# Altium schematic sheet PAGE3 - HUB, USB, ETH.SchDoc (part 2 of 2)
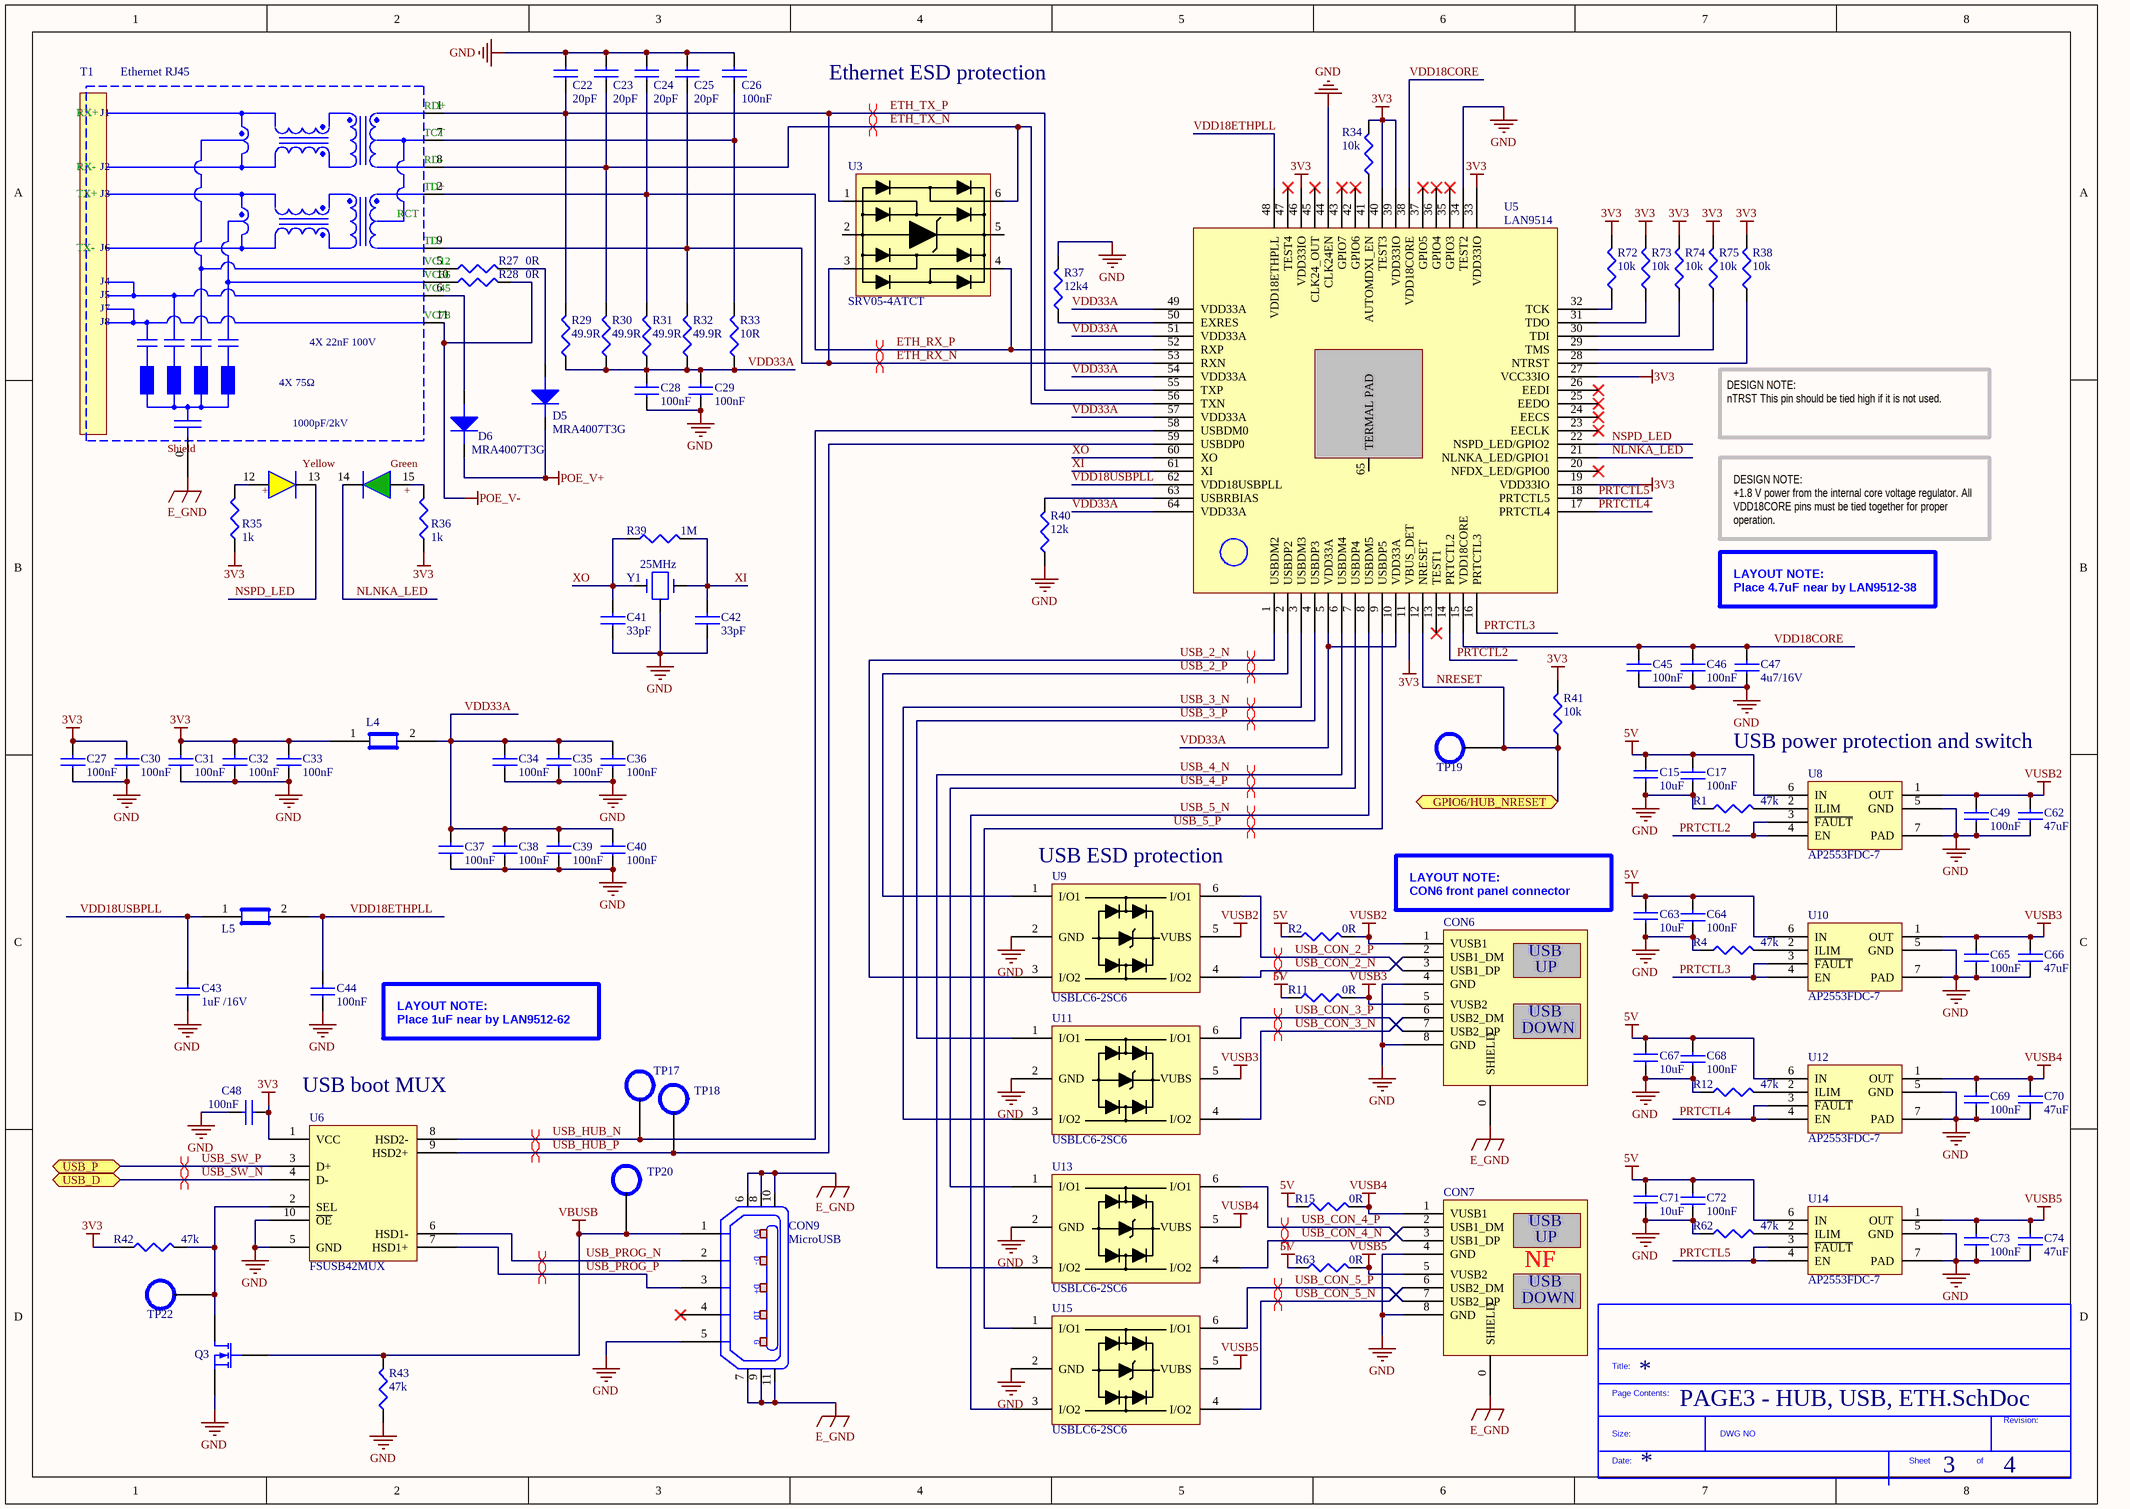
[diagram p1: PAGE3 - HUB, USB, ETH.SchDoc]

## Library data of the parts
C15 C63 C67 C71 = 10uF /50V: MURATA - GRM31CR61H106KA12L - CAP, MLCC, X5R, 10UF, 50V, 1206; Supplier 1: Farnell; Manufacturer: MURATA; Manufacturer Part Number: GRM31CR61H106KA12L; RoHS: YES; Stock 1: 51830; Pricing 1: 5=0.368, 50=0.214, 250=0.196, 500=0.178, 1000=0.159 (GBP); ComponentLink1URL: http://www.farnell.com/datasheets/2048767.pdf; ComponentLink1Description: http://www.farnell.com/datasheets/2048767.pdf; Supplier Part Number 1: 1845762
C17 C26-C40 C44-C46 C48 C49 C64 C65 C68 C69 C72 C73 = 100nF: MURATA - GRM188R71C104KA01J - CAP, MLCC, X7R, 0.1UF, 16V, 0603; Ceramic Capacitor Case: 0603 [1608 Metric]; Capacitance: 0.1; Voltage Rating: 16; Capacitance Tolerance: ± 10%; Dielectric Characteristic: X7; Product Range: GRM Series; SVHC: No SVHC (20-Jun-2016; Supplier 1: Farnell; Manufacturer: MURATA; Manufacturer Part Number: GRM188R71C104KA01J; RoHS: YES; Stock 1: 18297; Pricing 1: 10=0.0145, 100=0.0126, 500=0.0081, 2500=0.0059, 5000=0.0052, 10000=0.0046, 50000=0.0036, 100000=0.0035 (GBP); Packaging: Cut Tape; Operating Temperature Min: -55; Operating Temperature Max: 125; Automotive Qualification Standard: -; MSL: MSL 1 - Unlimited; ComponentLink1URL: http://www.farnell.com/datasheets/2189124.pdf; ComponentLink1Description: http://www.farnell.com/datasheets/2189124.pdf; Supplier Part Number 1: 2688519
C22-C25 = GRM1885C1H200JA01D: MURATA - GRM1885C1H200JA01D - CAPACITOR, MLCC, C0G, 20PF, 50V, 0603; Ceramic Capacitor Case: 0603 [1608 Metric]; Capacitance: 20; Voltage Rating: 50; Capacitance Tolerance: ± 5%; Dielectric Characteristic: C0G / NP0; Product Range: GRM Series; SVHC: No SVHC (17-Dec-2015; Supplier 1: Farnell; Manufacturer: MURATA; Manufacturer Part Number: GRM1885C1H200JA01D; RoHS: YES; Stock 1: 5812; Pricing 1: 10=0.0245, 100=0.0159, 500=0.0123, 1000=0.0095, 2000=0.0093, 4000=0.0073, 20000=0.0062, 40000=0.0057 (GBP); Packaging: Cut Tape; Operating Temperature Min: -55; Operating Temperature Max: 125; Automotive Qualification Standard: -; MSL: MSL 1 - Unlimited; ComponentLink1URL: http://www.farnell.com/datasheets/2048077.pdf; ComponentLink1Description: http://www.farnell.com/datasheets/2048077.pdf; Supplier Part Number 1: 2456108
C41 C42 = GRM1885C1H330JA01D: MURATA - GRM1885C1H330JA01D - CAP, MLCC, C0G/NP0, 33PF, 50V, 0603; Ceramic Capacitor Case: 0603 [1608 Metric]; Capacitance: 33; Voltage Rating: 50; Capacitance Tolerance: ± 5%; Product Range: GRM Series; SVHC: No SVHC (17-Dec-2015); Capacitor Terminals: SMD<!--FANDB--><div class="features-and-benefits-container"><div class="features-and-benefits-description"><span class="features-benefits-value">The Murata GRM series capacitors are Multilayer Ceramic Chip Capacitors (MLCC) used for general purpose applications. These MLCC capacitors are classified into temperature compensating and high dielectric constant types depending on the change in electrostatic capacitance due to change in temperature. The temperature compensating capacitors feature a small rate of change in electrostatic capacitance as the temperature changes and are used for applications such as filters and high frequency circuit matching. The high dielectric constant capacitors use materials with a high dielectric constant and feature a large electrostatic capacitance. Typical applications are power supply decoupling and smoothing circuits.</span></div><div class="features-and-benefits-list"><ul class="features-and-benefits-list-list"><li class="features-and-benefits-list-item">Large capacity and small size in a multilayer structure</li><li class="features-and-benefits-list-item">Capacitance value ranging from 0.1pF to 220?F</li><li class="features-and-benefits-list-item">Tin plated external electrodes, excellent solderability</li><li class="features-and-benefits-list-item">Provides good high frequency characteristics</li><li class="features-and-benefits-list-item">Excellent pulse response</li><li class="features-and-benefits-list-item">High reliability</li><li class="features-and-benefits-list-item">Capacitor size varies from 0.4×0.2mm to 5.7×5.0mm</li><li class="features-and-benefits-list-item">Rated voltage of 2.5VDC to 3.15; Supplier 1: Farnell; Manufacturer: MURATA; Manufacturer Part Number: GRM1885C1H330JA01D; RoHS: YES; Stock 1: 11752; Pricing 1: 10=0.0153, 100=0.0104, 500=0.0085, 1000=0.0069, 2000=0.0063 (GBP); Dielectric Characteristic: C0G / NP0; Packaging: Cut Tape; Operating Temperature Min: -55; Operating Temperature Max: 125; Automotive Qualification Standard: -; MSL: -; Capacitance Tolerance ±: ± 5%; ComponentLink1URL: http://www.farnell.com/datasheets/2048656.pdf; ComponentLink1Description: http://www.farnell.com/datasheets/2048656.pdf; Supplier Part Number 1: 1828910
C43 = GRM188R61C105KA12D: MURATA - GRM188R61C105KA12D - CAP, MLCC, X5R, 1UF, 16V, 0603; Ceramic Capacitor Case: 0603 [1608 Metric]; Capacitance: 1; Voltage Rating: 16; Capacitance Tolerance: ± 10%; Dielectric Characteristic: X5; Product Range: GRM Series; SVHC: No SVHC (17-Dec-2015); Capacitance Tolerance ±: ± 10%<!--FANDB--><div class="features-and-benefits-container"><div class="features-and-benefits-description"><span class="features-benefits-value">The Murata GRM series capacitors are Multilayer Ceramic Chip Capacitors (MLCC) used for general purpose applications. These MLCC capacitors are classified into temperature compensating and high dielectric constant types depending on the change in electrostatic capacitance due to change in temperature. The temperature compensating capacitors feature a small rate of change in electrostatic capacitance as the temperature changes and are used for applications such as filters and high frequency circuit matching. The high dielectric constant capacitors use materials with a high dielectric constant and feature a large electrostatic capacitance. Typical applications are power supply decoupling and smoothing circuits.</span></div><div class="features-and-benefits-list"><ul class="features-and-benefits-list-list"><li class="features-and-benefits-list-item">Large capacity and small size in a multilayer structure</li><li class="features-and-benefits-list-item">Capacitance value ranging from 0.1pF to 220?F</li><li class="features-and-benefits-list-item">Tin plated external electrodes, excellent solderability</li><li class="features-and-benefits-list-item">Provides good high frequency characteristics</li><li class="features-and-benefits-list-item">Excellent pulse response</li><li class="features-and-benefits-list-item">High reliability</li><li class="features-and-benefits-list-item">Capacitor size varies from 0.4×0.2mm to 5.7×5.0mm</li><li class="features-and-benefits-list-item">Rated voltage of 2.5VDC to 3.15; Supplier 1: Farnell; Manufacturer: MURATA; Manufacturer Part Number: GRM188R61C105KA12D; RoHS: YES; Stock 1: 27380; Pricing 1: 10=0.0194, 100=0.013, 500=0.0101, 1000=0.0078, 2000=0.0074 (GBP); Packaging: Cut Tape; Operating Temperature Min: -55; Operating Temperature Max: 85; Automotive Qualification Standard: -; MSL: MSL 1 - Unlimited; ComponentLink1URL: http://www.farnell.com/datasheets/2047881.pdf; ComponentLink1Description: http://www.farnell.com/datasheets/2047881.pdf; ComponentLink2URL: http://www.farnell.com/datasheets/2006461.pdf; ComponentLink2Description: http://www.farnell.com/datasheets/2006461.pdf; Supplier Part Number 1: 2362099RL
C47 = 4u7  16V 0603: MURATA - GRM188R61C475KAAJD - CAP, MLCC, X5R, 4.7UF, 16V, 0603; Ceramic Capacitor Case: 0603 [1608 Metric]; Capacitance: 4.7; Voltage Rating: 16; Capacitance Tolerance: ± 10%; Dielectric Characteristic: X5; Product Range: GRM Series; SVHC: No SVHC (17-Dec-2015)<!--FANDB--><div class="features-and-benefits-container"><div class="features-and-benefits-desc-container"><span class="features-and-benefits-container-desc">SMD Multilayer Ceramic Capacitor, 0603 [1608 Metric], 4.7 µF, 16 V, ± 10%, X5; Supplier 1: Farnell; Manufacturer: MURATA; Manufacturer Part Number: GRM188R61C475KAAJD; RoHS: YES; Stock 1: 5038; Pricing 1: 10=0.16, 100=0.0929, 500=0.076, 1000=0.0618, 2000=0.0605, 4000=0.0425, 20000=0.0409, 40000=0.0355 (GBP); Packaging: Cut Tape; Operating Temperature Min: -55; Operating Temperature Max: 85; Automotive Qualification Standard: -; MSL: MSL 1 - Unlimited; ComponentLink1URL: http://www.farnell.com/datasheets/2079168.pdf; ComponentLink1Description: http://www.farnell.com/datasheets/2079168.pdf; Supplier Part Number 1: 2611924
C62 C66 C70 C74 = 47uF /10V: MURATA - GRM21BR61A476ME15L - CAP, MLCC, X5R, 47UF, 10V, 0805; Ceramic Capacitor Case: 0805 [2012 Metric]; Capacitance: 47; Voltage Rating: 10; Capacitance Tolerance: ± 20%; Dielectric Characteristic: X5; Product Range: GRM Series; SVHC: No SVHC (17-Dec-2015; Supplier 1: Farnell; Manufacturer: MURATA; Manufacturer Part Number: GRM21BR61A476ME15L; RoHS: YES; Stock 1: 27604; Pricing 1: 5=0.699, 50=0.295, 250=0.232, 500=0.193, 1500=0.171 (GBP); Packaging: Cut Tape; Operating Temperature Min: -55; Operating Temperature Max: 85; Automotive Qualification Standard: -; MSL: MSL 1 - Unlimited; ComponentLink1URL: http://www.farnell.com/datasheets/2079183.pdf; ComponentLink1Description: http://www.farnell.com/datasheets/2079183.pdf; Supplier Part Number 1: 2611939
CON6 CON7 = USB_2_CONN: USB 2.0 A Dual Port RA TH, PN0205
D5 D6 = MRA4007T3G: ON SEMICONDUCTOR - MRA4007T3G - DIODE, STANDARD, 1A, 1KV, SMA; Supplier 1: Farnell; Manufacturer: ON SEMICONDUCTOR; Manufacturer Part Number: MRA4007T3G; RoHS: YES; Stock 1: 92210; Pricing 1: 10=0.181, 100=0.0749, 500=0.0692, 1000=0.0478, 2500=0.0401 (GBP); ComponentLink1URL: http://www.onsemi.com/PowerSolutions/supportDoc.do?type=models&rpn=MRA4007; ComponentLink1Description: http://www.onsemi.com/PowerSolutions/supportDoc.do?type=models&rpn=MRA4007; ComponentLink2URL: http://www.farnell.com/datasheets/2028669.pdf; ComponentLink2Description: http://www.farnell.com/datasheets/2028669.pdf; ComponentLink3URL: http://www.farnell.com/datasheets/2037280.pdf; ComponentLink3Description: http://www.farnell.com/datasheets/2037280.pdf; Supplier Part Number 1: 1459137
L4 L5 = BLM18EG221SN1D: MURATA - BLM18EG221SN1D - FERRITE BEAD, 0.05OHM, 2A, 0603; Impedance @ 100MHz: 220; Ferrite Case Style: 0603 [1608 Metric]; Product Range: BLM18; DC Current Rating: 2; DC Resistance Max: 0.05; Impedance Tolerance: ± 25%; SVHC: No SVHC (17-Dec-2015); Ferrite Mounting: SMD; Resistance: 0.05ohm<!--FANDB--><div class="features-and-benefits-container"><div class="features-and-benefits-description"><span class="features-benefits-value">The Murata BLM18EG series are EMIFIL chip ferrite beads for suppressing high frequency noise in GHz band general signal line applications. These chip ferrite beads are designed for reducing the possibility of resonance to provide undistorted signal waveform. EMIFIL chip ferrite beads do not require connection to ground so they are effectively used in circuits without stable ground lines. The nickel barrier structure of the external electrodes provides excellent solder heat resistance. BLM18EG series has modified internal electrode structure that minimizes stray capacitance and increases the effective frequency range.</span></div><div class="features-and-benefits-list"><ul class="features-and-benefits-list-list"><li class="features-and-benefits-list-item">EIA 0603 standard chip size</li><li class="features-and-benefits-list-item">Miniaturized ferrite beads</li><li class="features-and-benefits-list-item">Effective at low impedance line</li><li class="features-and-benefits-list-item">Available in selective impedance range values at 100MHz</li><li class="features-and-benefits-list-item">Low DC resistance</li><li class="features-and-benefits-list-item">Large rated current</li><li class="features-and-benefits-list-item">Excellent direct current characteristics</li><li class="features-and-benefits-list-item">Suitable for small and low profile equipments</li><li class="features-and-benefits-list-item">Operating temperature range -55°C to 125; Supplier 1: Farnell; Manufacturer: MURATA; Manufacturer Part Number: BLM18EG221SN1D; RoHS: YES; Stock 1: 36495; Pricing 1: 10=0.0777, 100=0.064, 500=0.0516, 1000=0.038, 2000=0.033, 4000=0.03, 20000=0.0295, 40000=0.0262 (GBP); Automotive Qualification Standard: -; Core Material: Ferrite; Operating Temperature Max: +125; Operating Temperature Min: -55; Packaging: Cut Tape; ComponentLink1URL: http://www.farnell.com/datasheets/5169.pdf; ComponentLink1Description: http://www.farnell.com/datasheets/5169.pdf; Supplier Part Number 1: 1515716
Q3 = DMG1012T-7: MOSFET MOSFET N-CHANNEL SOT-523; Manufacturer: Diodes Incorporated; Configuration: 1 N-Channel; Number of Channels: 1 Channel; Channel Mode: Enhancement; Fall Time: 12.3 ns; Id - Continuous Drain Current: 630 mA; Pd - Power Dissipation: 280 mW; Qg - Gate Charge: 736.6 pC; Rds On - Drain-Source Resistance: 300 mOhms; Rise Time: 7.4 ns; Typical Turn-Off Delay Time: 26.7 ns; Typical Turn-On Delay Time: 5.1 ns; Vds - Drain-Source Breakdown Voltage: 20 V; Vgs - Gate-Source Voltage: +/- 6 V; Vgs th - Gate-Source Threshold Voltage: 500 mV; Supplier 1: Mouser; Manufacturer Part Number: DMG1012T-7; RoHS: RoHS Compliant; Category: MOSFET; Stock 1: 1195; Pricing 1: 1=0.273, 10=0.187, 100=0.077, 1000=0.053, 3000=0.041, 9000=0.035, 24000=0.033, 45000=0.031, 99000=0.027 (EUR); Package/Case: SOT-523-3; Packaging: Reel; Product: MOSFET Small Signal; Series: DMG1012; Technology: Si; Transistor Type: 1 N-Channel; Brand: Diodes Incorporated; Mounting Style: SMD/SMT; Transistor Polarity: N-Channel; Maximum Operating Temperature: + 150 C; Minimum Operating Temperature: - 55 C; Standard Pack Qty: 3000; RoHS - Mouser: Y; Minimum Order Quantity: 1; Reeling: True; ComponentLink1URL: http://www.mouser.com/ds/2/115/ds31783-44973.pdf; ComponentLink1Description: http://www.mouser.com/ds/2/115/ds31783-44973.pdf; Supplier Part Number 1: 621-DMG1012T-7
R1 R4 R12 R62 = 47k: MULTICOMP - MCMR06X4702FTL - RES, CERAMIC, 47K, 1%, 0.1W, 0603; Resistance: 47; Voltage Rating: 75; Resistor Case Style: 0603 [1608 Metric]; Power Rating: 100; Product Range: MCMR Series; Temperature Coefficient: ± 100; Automotive Qualification Standard: -<!--FANDB--><div class="features-and-benefits-container"><div class="features-and-benefits-description"><span class="features-benefits-value">The Multicomp MCMR series resistors are automotive grade, anti sulphured thick film chip resistor. The resistance range includes E24 and E96 decade values from 1ohm to 10Mohm. These resistors are constructed on top of a high grade ceramic body.</span></div><div class="features-and-benefits-list"><ul class="features-and-benefits-list-list"><li class="features-and-benefits-list-item">EIA 0402, 0603, 0805, 1206 chip sizes available</li><li class="features-and-benefits-list-item">High reliability and stability</li><li class="features-and-benefits-list-item">Automotive grade AEC-Q200 compliant</li><li class="features-and-benefits-list-item">Complaint with (IEC 60068-1) 55/155/56 climatic category</li><li class="features-and-benefits-list-item">Maximum operation voltage of 50V, 75V, 150V and 200V</li><li class="features-and-benefits-list-item">Power rating of 62.5mW, 100mW, 125mW and 250mW</li><li class="features-and-benefits-list-item">Available in ±1% and ±5% tolerance</li><li class="features-and-benefits-list-item">Temperature coefficient (TCR) of +200ppm/°C, +100ppm/°C and -200ppm/°C to +400ppm/°C</li><li class="features-and-benefits-list-item">Operating temperature range -55°C to 155; Supplier 1: Farnell; Manufacturer: MULTICOMP; Manufacturer Part Number: MCMR06X4702FTL; RoHS: Y-EX; Stock 1: 21427; Pricing 1: 10=0.0115, 100=0.009, 500=0.0064, 1000=0.0051, 2500=0.0042, 5000=0.0032, 25000=0.0021, 50000=0.0017 (GBP); Resistance Tolerance: ± 1%; Packaging: Cut Tape; Resistor Element Material: Ceramic; ComponentLink1URL: http://www.farnell.com/datasheets/1716707.pdf; ComponentLink1Description: http://www.farnell.com/datasheets/1716707.pdf; Supplier Part Number 1: 2073510
R2 R11 R15 R63 = 0R: BOURNS - CR0603-J/-000ELF - RES, THICK FILM, 0R, 5%, 0.1W, 0603; Resistance: 0; Voltage Rating: 50; Resistor Case Style: 0603 [1608 Metric]; Power Rating: 100; Product Range: CR Series; SVHC: No SVHC (17-Dec-2015); Resistor Mounting: Surface Mount Device<!--FANDB--><div class="features-and-benefits-container"><div class="features-and-benefits-description"><span class="features-benefits-value">The Bourns CR series are standard thick film chip resistors. These resistors provide flexibility of performance, space saving and low cost. The Resistance range includes E96 and E24 decade values from 1ohm to 10Mohm.</span></div><div class="features-and-benefits-list"><ul class="features-and-benefits-list-list"><li class="features-and-benefits-list-item">0201, 0402, 0603, 0805, 1206, 1210, 2010, 2512 standard case sizes available</li><li class="features-and-benefits-list-item">±1% and ±5% tolerance</li><li class="features-and-benefits-list-item">±100ppm/°C, ±200ppm/°C and ±250ppm/°C TCR values available</li><li class="features-and-benefits-list-item">Power rating selectable for 50mW, 63mW, 0.1W, 0.125W, 0.25W, 0.5W and 1W based on ordering</li><li class="features-and-benefits-list-item">Jumpers are available for all size</li><li class="features-and-benefits-list-item">3 layer termination process with nickel barrier prevents leaching & provides excellent solderability</li><li class="features-and-benefits-list-item">Suitable for all type of soldering processes</li><li class="features-and-benefits-list-item">Tight dimensional tolerances</li><li class="features-and-benefits-list-item">Maximum working voltage depends on case size</li><li class="features-and-benefits-list-item">Operating temperature of -55°C to +125°C(CR0201) and -55°C to +155; Supplier 1: Farnell; Manufacturer: BOURNS; Manufacturer Part Number: CR0603-J/-000ELF; RoHS: YES; Stock 1: 58200; Pricing 1: 10=0.0146, 250=0.0097, 1000=0.0073, 5000=0.0049, 12500=0.0042 (GBP); Resistance Tolerance: ± 5%; Packaging: Cut Tape; Resistor Element Material: Thick Film; Temperature Coefficient: -; Automotive Qualification Standard: -; MSL: MSL 1 - Unlimited; ComponentLink1URL: http://www.bourns.com/engineering/CHPREZTR/cr0603.stp; ComponentLink1Description: http://www.bourns.com/engineering/CHPREZTR/cr0603.stp; ComponentLink2URL: http://www.farnell.com/datasheets/2178762.pdf; ComponentLink2Description: http://www.farnell.com/datasheets/2178762.pdf; Supplier Part Number 1: 2008343
R27 R28 = MCMR12X000 PTL: MULTICOMP - MCMR12X000 PTL - RES, CERAMIC, 0R, 0.05OHM, 0.25W, 1206; Resistance: 0; Voltage Rating: 200; Resistor Case Style: 1206 [3216 Metric]; Power Rating: 250; Resistance Tolerance: ± 0.05; Product Range: MCMR Series; Temperature Coefficient: -200ppm/°C to +400; Automotive Qualification Standard: -<!--FANDB--><div class="features-and-benefits-container"><div class="features-and-benefits-description"><span class="features-benefits-value">The Multicomp MCMR series resistors are automotive grade, anti sulphured thick film chip resistor. The resistance range includes E24 and E96 decade values from 1ohm to 10Mohm. These resistors are constructed on top of a high grade ceramic body.</span></div><div class="features-and-benefits-list"><ul class="features-and-benefits-list-list"><li class="features-and-benefits-list-item">EIA 0402, 0603, 0805, 1206 chip sizes available</li><li class="features-and-benefits-list-item">High reliability and stability</li><li class="features-and-benefits-list-item">Automotive grade AEC-Q200 compliant</li><li class="features-and-benefits-list-item">Complaint with (IEC 60068-1) 55/155/56 climatic category</li><li class="features-and-benefits-list-item">Maximum operation voltage of 50V, 75V, 150V and 200V</li><li class="features-and-benefits-list-item">Power rating of 62.5mW, 100mW, 125mW and 250mW</li><li class="features-and-benefits-list-item">Available in ±1% and ±5% tolerance</li><li class="features-and-benefits-list-item">Temperature coefficient (TCR) of +200ppm/°C, +100ppm/°C and -200ppm/°C to +400ppm/°C</li><li class="features-and-benefits-list-item">Operating temperature range -55°C to 155; Supplier 1: Farnell; Manufacturer: MULTICOMP; Manufacturer Part Number: MCMR12X000 PTL; RoHS: Y-EX; Stock 1: 526857; Pricing 1: 10=0.0252, 100=0.0179, 500=0.0111, 1000=0.0092, 2500=0.0069, 5000=0.0055, 25000=0.0037, 50000=0.0029 (GBP); Packaging: Cut Tape; Resistor Element Material: Ceramic; ComponentLink1URL: http://www.farnell.com/datasheets/1716709.pdf; ComponentLink1Description: http://www.farnell.com/datasheets/1716709.pdf; Supplier Part Number 1: 2073874
R29-R32 = CRCW060349R9FKEA: VISHAY - CRCW060349R9FKEA - RES, THICK FILM, 49R9, 1%, 0.1W, 0603; Resistance: 49.9; Voltage Rating: 75; Resistor Case Style: 0603 [1608 Metric]; Power Rating: 100; Product Range: CRCW Series; Temperature Coefficient: ± 100; Automotive Qualification Standard: AEC-Q200; Resistor Mounting: Surface Mount Device<!--FANDB--><div class="features-and-benefits-container"><div class="features-and-benefits-description"><span class="features-benefits-value">The Vishay D/CRCW e3 series are standard thick film chip resistors. The resistance range includes E96 and E24 decade values from 1ohm to 10Mohm. CRCW e3 series resistors have a pure tin solder contacts on the Ni barrier layer that provides compatibility with reflow soldering process.</span></div><div class="features-and-benefits-list"><ul class="features-and-benefits-list-list"><li class="features-and-benefits-list-item">Automotive grade AEC-Q200 qualified</li><li class="features-and-benefits-list-item">EIA 0402, 0603, 0805, 1206, 1210, 1218, 2010, 2512 standard case sizes available</li><li class="features-and-benefits-list-item">Stability &Delta; Supplier 1: Farnell; Manufacturer: VISHAY; Manufacturer Part Number: CRCW060349R9FKEA; RoHS: Y-EX; Stock 1: 45411; Pricing 1: 10=0.0158, 100=0.0094, 500=0.0071, 1000=0.0052, 2500=0.0047 (GBP); Resistance Tolerance: ± 1%; Packaging: Cut Tape; Resistor Element Material: Thick Film; MSL: MSL 1 - Unlimited; ComponentLink1URL: http://www.farnell.com/datasheets/2111203.pdf; ComponentLink1Description: http://www.farnell.com/datasheets/2111203.pdf; ComponentLink2URL: http://www.farnell.com/cad/1552291.zip; ComponentLink2Description: http://www.farnell.com/cad/1552291.zip; Supplier Part Number 1: 1469817
R33 = RCA060310R0FKEA: VISHAY - RCA060310R0FKEA - RES, AUTO, THICK FILM, 10R, 1%, 0603; Resistance: 10; Voltage Rating: 75; Resistor Case Style: 0603 [1608 Metric]; Power Rating: 100; Product Range: RCA Series; Temperature Coefficient: ± 100; Automotive Qualification Standard: AEC-Q200; SVHC: No SVHC (17-Dec-2015)<!--FANDB--><div class="features-and-benefits-container"><div class="features-and-benefits-description"><span class="features-benefits-value">The RCA series from Vishay are automotive grade, sulphur resistant thick film rectangular chip resistors. The resistance range includes E24 and E96 decade values from 1ohm to 10Mohm. They provide superior resistance against H2S atmosphere. These resistors have metal glaze on high quality ceramic.</span></div><div class="features-and-benefits-list"><ul class="features-and-benefits-list-list"><li class="features-and-benefits-list-item">Automotive grade AEC-Q200 qualified (rev C)</li><li class="features-and-benefits-list-item">EIA 0402, 0603, 0805, 1206, 1210, 1218, 2010 and 2512 case sizes available</li><li class="features-and-benefits-list-item">Available in ±0.5%, ±1% and ±5% tolerances</li><li class="features-and-benefits-list-item">Jumpers are also available</li><li class="features-and-benefits-list-item">±50ppm/K, ±100ppm/K and ±200ppm/K TCR values</li><li class="features-and-benefits-list-item">Power rating of 0.063W, 0.10W, 0.125W, 0.25W, 0.5W, 0.75W and 1W at 70?C</li><li class="features-and-benefits-list-item">Available in 50V, 75V, 150V, 200V, 400V and 500V limiting voltage options</li><li class="features-and-benefits-list-item">Category temperature range from -55?C to 155?C</li><li class="features-and-benefits-list-item">Stability ?R/R = 1 % for 1000h at 70; Supplier 1: Farnell; Manufacturer: VISHAY; Manufacturer Part Number: RCA060310R0FKEA; RoHS: YES; Stock 1: 9559; Pricing 1: 10=0.0803, 100=0.0386, 500=0.0235, 2500=0.015, 5000=0.0135, 10000=0.0108, 50000=0.0068, 100000=0.0067 (GBP); Resistance Tolerance: ± 1%; Packaging: Cut Tape; Resistor Element Material: Thick Film; ComponentLink1URL: http://www.farnell.com/datasheets/2111201.pdf; ComponentLink1Description: http://www.farnell.com/datasheets/2111201.pdf; Supplier Part Number 1: 2616585
R34 R38 R41 R72-R75 = MCMR06X103 JTL: MULTICOMP - MCMR06X103 JTL - RES, CERAMIC, 10K, 5%, 0.1W, 0603; Resistance: 10; Voltage Rating: 75; Resistor Case Style: 0603 [1608 Metric]; Power Rating: 100; Product Range: MCMR Series; Temperature Coefficient: ± 100; Automotive Qualification Standard: -<!--FANDB--><div class="features-and-benefits-container"><div class="features-and-benefits-description"><span class="features-benefits-value">The Multicomp MCMR series resistors are automotive grade, anti sulphured thick film chip resistor. The resistance range includes E24 and E96 decade values from 1ohm to 10Mohm. These resistors are constructed on top of a high grade ceramic body.</span></div><div class="features-and-benefits-list"><ul class="features-and-benefits-list-list"><li class="features-and-benefits-list-item">EIA 0402, 0603, 0805, 1206 chip sizes available</li><li class="features-and-benefits-list-item">High reliability and stability</li><li class="features-and-benefits-list-item">Automotive grade AEC-Q200 compliant</li><li class="features-and-benefits-list-item">Complaint with (IEC 60068-1) 55/155/56 climatic category</li><li class="features-and-benefits-list-item">Maximum operation voltage of 50V, 75V, 150V and 200V</li><li class="features-and-benefits-list-item">Power rating of 62.5mW, 100mW, 125mW and 250mW</li><li class="features-and-benefits-list-item">Available in ±1% and ±5% tolerance</li><li class="features-and-benefits-list-item">Temperature coefficient (TCR) of +200ppm/°C, +100ppm/°C and -200ppm/°C to +400ppm/°C</li><li class="features-and-benefits-list-item">Operating temperature range -55°C to 155; Supplier 1: Farnell; Manufacturer: MULTICOMP; Manufacturer Part Number: MCMR06X103 JTL; RoHS: Y-EX; Stock 1: 19791; Pricing 1: 10=0.0087, 100=0.0074, 500=0.0061, 1000=0.0048, 2500=0.0032, 5000=0.0024, 25000=0.0016, 50000=0.0013 (GBP); Resistance Tolerance: ± 5%; Packaging: Cut Tape; Resistor Element Material: Ceramic; ComponentLink1URL: http://www.farnell.com/datasheets/1716707.pdf; ComponentLink1Description: http://www.farnell.com/datasheets/1716707.pdf; Supplier Part Number 1: 2073356
R35 R36 = MCMR06X102 JTL: MULTICOMP - MCMR06X102 JTL - RES, CERAMIC, 1K, 5%, 0.1W, 0603; Resistance: 1; Voltage Rating: 75; Resistor Case Style: 0603 [1608 Metric]; Power Rating: 100; Product Range: MCMR Series; Temperature Coefficient: ± 100; Resistor Mounting: Surface Mount Device<!--FANDB--><div class="features-and-benefits-container"><div class="features-and-benefits-description"><span class="features-benefits-value">The Multicomp MCMR series resistors are automotive grade, anti sulphured thick film chip resistor. The resistance range includes E24 and E96 decade values from 1ohm to 10Mohm. These resistors are constructed on top of a high grade ceramic body.</span></div><div class="features-and-benefits-list"><ul class="features-and-benefits-list-list"><li class="features-and-benefits-list-item">EIA 0402, 0603, 0805, 1206 chip sizes available</li><li class="features-and-benefits-list-item">High reliability and stability</li><li class="features-and-benefits-list-item">Automotive grade AEC-Q200 compliant</li><li class="features-and-benefits-list-item">Complaint with (IEC 60068-1) 55/155/56 climatic category</li><li class="features-and-benefits-list-item">Maximum operation voltage of 50V, 75V, 150V and 200V</li><li class="features-and-benefits-list-item">Power rating of 62.5mW, 100mW, 125mW and 250mW</li><li class="features-and-benefits-list-item">Available in ±1% and ±5% tolerance</li><li class="features-and-benefits-list-item">Temperature coefficient (TCR) of +200ppm/°C, +100ppm/°C and -200ppm/°C to +400ppm/°C</li><li class="features-and-benefits-list-item">Operating temperature range -55°C to 155; Supplier 1: Farnell; Manufacturer: MULTICOMP; Manufacturer Part Number: MCMR06X102 JTL; RoHS: Y-EX; Stock 1: 18133; Pricing 1: 10=0.0089, 100=0.0076, 500=0.0063, 1000=0.0049, 2500=0.0033, 5000=0.0024, 25000=0.0016, 50000=0.0013 (GBP); Resistance Tolerance: ± 5%; Packaging: Cut Tape; Resistor Element Material: Ceramic; Automotive Qualification Standard: -; ComponentLink1URL: http://www.farnell.com/datasheets/1716707.pdf; ComponentLink1Description: http://www.farnell.com/datasheets/1716707.pdf; Supplier Part Number 1: 2073354
R37 = MC0063W0603112K4: MULTICOMP - MC0063W0603112K4 - RES, THICK FILM, 12K4, 1%, 0.063W, 0603; Resistance: 12.4; Voltage Rating: 50; Resistor Case Style: 0603 [1608 Metric]; Power Rating: 63; Product Range: MC Series; Temperature Coefficient: ± 100; SVHC: No SVHC (17-Dec-2015); External Depth: 0.45; External Length / Height: 1.6; External Width: 0.8; No. of Pins: 2; Reel Quantity: 5000; Resistor Mounting: Surface Mount Device; Temperature Coeff. +: 100; Voltage Rating V DC: 50V<!--FANDB--><div class="features-and-benefits-container"><div class="features-and-benefits-description"><span class="features-benefits-value">The Multicomp MC series current sense resistors are thick film chip resistors. The resistance range includes E96 and E24 decade values from 1ohm to 10Mohm.</span></div><div class="features-and-benefits-list"><ul class="features-and-benefits-list-list"><li class="features-and-benefits-list-item">EIA 0402, 0603, 0805, 1206 chip sizes available</li><li class="features-and-benefits-list-item">Small size and low weight</li><li class="features-and-benefits-list-item">Suitable for both wave and reflow soldering</li><li class="features-and-benefits-list-item">Reduction of assembly costs</li><li class="features-and-benefits-list-item">Maximum working voltage of 50V(0402, 0603), 150V(0805), 200V(1206)</li><li class="features-and-benefits-list-item">Available in ±1%, ±2% and ±5% tolerance</li><li class="features-and-benefits-list-item">Power rating of 62.5mW, 100mW and 125mW</li><li class="features-and-benefits-list-item">±400ppm/°C(1ohm to 10ohm), ±200ppm/°C(11ohm to 100ohm), ±100; Supplier 1: Farnell; Manufacturer: MULTICOMP; Manufacturer Part Number: MC0063W0603112K4; RoHS: Y-EX; Stock 1: 16712; Pricing 1: 10=0.0113, 1000=0.005, 1250=0.0046, 1750=0.0041, 2500=0.004 (GBP); Resistance Tolerance: ± 1%; Packaging: Cut Tape; Resistor Element Material: Thick Film; Automotive Qualification Standard: -; Operating Temperature Max: 155; Operating Temperature Min: -55; Operating Temperature Range: -55°C to +155; Tape Width: 8; Temperature Coeff. -: 100; Tolerance +: 1%; Tolerance -: 1%; ComponentLink1URL: http://www.farnell.com/datasheets/1788326.pdf; ComponentLink1Description: http://www.farnell.com/datasheets/1788326.pdf; ComponentLink2URL: http://www.farnell.com/cad/1561155.zip; ComponentLink2Description: http://www.farnell.com/cad/1561155.zip; Supplier Part Number 1: 1170897
R39 = MC0063W060311M: MULTICOMP - MC0063W060311M - RES, THICK FILM, 1M, 1%, 0.063W, 0603; Resistance: 1; Voltage Rating: 50; Resistor Case Style: 0603 [1608 Metric]; Power Rating: 63; Product Range: MC Series; Temperature Coefficient: ± 100; SVHC: No SVHC (17-Dec-2015); External Depth: 0.45; External Length / Height: 1.6; External Width: 0.8; No. of Pins: 2; Reel Quantity: 5000; Resistor Mounting: Surface Mount Device; Temperature Coeff. +: 100; Voltage Rating V DC: 50V<!--FANDB--><div class="features-and-benefits-container"><div class="features-and-benefits-description"><span class="features-benefits-value">The Multicomp MC series current sense resistors are thick film chip resistors. The resistance range includes E96 and E24 decade values from 1ohm to 10Mohm.</span></div><div class="features-and-benefits-list"><ul class="features-and-benefits-list-list"><li class="features-and-benefits-list-item">EIA 0402, 0603, 0805, 1206 chip sizes available</li><li class="features-and-benefits-list-item">Small size and low weight</li><li class="features-and-benefits-list-item">Suitable for both wave and reflow soldering</li><li class="features-and-benefits-list-item">Reduction of assembly costs</li><li class="features-and-benefits-list-item">Maximum working voltage of 50V(0402, 0603), 150V(0805), 200V(1206)</li><li class="features-and-benefits-list-item">Available in ±1%, ±2% and ±5% tolerance</li><li class="features-and-benefits-list-item">Power rating of 62.5mW, 100mW and 125mW</li><li class="features-and-benefits-list-item">±400ppm/°C(1ohm to 10ohm), ±200ppm/°C(11ohm to 100ohm), ±100; Supplier 1: Farnell; Manufacturer: MULTICOMP; Manufacturer Part Number: MC0063W060311M; RoHS: Y-EX; Stock 1: 333415; Pricing 1: 10=0.0011, 100=0.001, 500=0.0009, 1000=0.0008, 2500=0.0007 (GBP); Resistance Tolerance: ± 1%; Packaging: Cut Tape; Resistor Element Material: Thick Film; Automotive Qualification Standard: -; Operating Temperature Max: 155; Operating Temperature Min: -55; Operating Temperature Range: -55°C to +155; Tape Width: 8; Temperature Coeff. -: 100; Tolerance +: 1%; Tolerance -: 1%; ComponentLink1URL: http://www.farnell.com/datasheets/1788326.pdf; ComponentLink1Description: http://www.farnell.com/datasheets/1788326.pdf; ComponentLink2URL: http://www.farnell.com/cad/1558928.zip; ComponentLink2Description: http://www.farnell.com/cad/1558928.zip; Supplier Part Number 1: 9330410
R40 = MC0063W0603112K: MULTICOMP - MC0063W0603112K - RES, THICK FILM, 12K, 1%, 0.063W, 0603; Resistance: 12; Voltage Rating: 50; Resistor Case Style: 0603 [1608 Metric]; Power Rating: 63; Product Range: MC Series; Temperature Coefficient: ± 100; Reel Quantity: 5000; Resistor Mounting: Surface Mount Device<!--FANDB--><div class="features-and-benefits-container"><div class="features-and-benefits-description"><span class="features-benefits-value">The Multicomp MC series current sense resistors are thick film chip resistors. The resistance range includes E96 and E24 decade values from 1ohm to 10Mohm.</span></div><div class="features-and-benefits-list"><ul class="features-and-benefits-list-list"><li class="features-and-benefits-list-item">EIA 0402, 0603, 0805, 1206 chip sizes available</li><li class="features-and-benefits-list-item">Small size and low weight</li><li class="features-and-benefits-list-item">Suitable for both wave and reflow soldering</li><li class="features-and-benefits-list-item">Reduction of assembly costs</li><li class="features-and-benefits-list-item">Maximum working voltage of 50V(0402, 0603), 150V(0805), 200V(1206)</li><li class="features-and-benefits-list-item">Available in ±1%, ±2% and ±5% tolerance</li><li class="features-and-benefits-list-item">Power rating of 62.5mW, 100mW and 125mW</li><li class="features-and-benefits-list-item">±400ppm/°C(1ohm to 10ohm), ±200ppm/°C(11ohm to 100ohm), ±100; Supplier 1: Farnell; Manufacturer: MULTICOMP; Manufacturer Part Number: MC0063W0603112K; RoHS: Y-EX; Stock 1: 784996; Pricing 1: 5000=0.0006, 25000=0.0005, 50000=0.0004 (GBP); Resistance Tolerance: ± 1%; Packaging: Tape & Reel; Resistor Element Material: Thick Film; Automotive Qualification Standard: -; ComponentLink1URL: http://www.farnell.com/datasheets/1788326.pdf; ComponentLink1Description: http://www.farnell.com/datasheets/1788326.pdf; ComponentLink2URL: http://www.farnell.com/datasheets/1944283.pdf; ComponentLink2Description: http://www.farnell.com/datasheets/1944283.pdf; Supplier Part Number 1: 2130943
R42 R43 = MCMR06X4702FTL: MULTICOMP - MCMR06X4702FTL - RES, CERAMIC, 47K, 1%, 0.1W, 0603; Resistance: 47; Voltage Rating: 75; Resistor Case Style: 0603 [1608 Metric]; Power Rating: 100; Product Range: MCMR Series; Temperature Coefficient: ± 100; Automotive Qualification Standard: -<!--FANDB--><div class="features-and-benefits-container"><div class="features-and-benefits-description"><span class="features-benefits-value">The Multicomp MCMR series resistors are automotive grade, anti sulphured thick film chip resistor. The resistance range includes E24 and E96 decade values from 1ohm to 10Mohm. These resistors are constructed on top of a high grade ceramic body.</span></div><div class="features-and-benefits-list"><ul class="features-and-benefits-list-list"><li class="features-and-benefits-list-item">EIA 0402, 0603, 0805, 1206 chip sizes available</li><li class="features-and-benefits-list-item">High reliability and stability</li><li class="features-and-benefits-list-item">Automotive grade AEC-Q200 compliant</li><li class="features-and-benefits-list-item">Complaint with (IEC 60068-1) 55/155/56 climatic category</li><li class="features-and-benefits-list-item">Maximum operation voltage of 50V, 75V, 150V and 200V</li><li class="features-and-benefits-list-item">Power rating of 62.5mW, 100mW, 125mW and 250mW</li><li class="features-and-benefits-list-item">Available in ±1% and ±5% tolerance</li><li class="features-and-benefits-list-item">Temperature coefficient (TCR) of +200ppm/°C, +100ppm/°C and -200ppm/°C to +400ppm/°C</li><li class="features-and-benefits-list-item">Operating temperature range -55°C to 155; Supplier 1: Farnell; Manufacturer: MULTICOMP; Manufacturer Part Number: MCMR06X4702FTL; RoHS: Y-EX; Stock 1: 21427; Pricing 1: 10=0.0115, 100=0.009, 500=0.0064, 1000=0.0051, 2500=0.0042, 5000=0.0032, 25000=0.0021, 50000=0.0017 (GBP); Resistance Tolerance: ± 1%; Packaging: Cut Tape; Resistor Element Material: Ceramic; ComponentLink1URL: http://www.farnell.com/datasheets/1716707.pdf; ComponentLink1Description: http://www.farnell.com/datasheets/1716707.pdf; Supplier Part Number 1: 2073510
T1 = Ethernet RJ45: 1 Port RJ45 Magjack Connector Through Hole 10/100 Base-T, AutoMDIX, Power over Ethernet (PoE); Manufacturer: Bel Fuse; Gender: Jack; Mounting Angle: Right Angle; Number of Positions: 8 Position; Shielding: Shielded; Number of Ports: 1 Port; Supplier 1: Mouser; Supplier Part Number 1: 530-0826-1L1T-57-F; Manufacturer Part Number: 0826-1L1T-57-F; RoHS: RoHS Compliant; Category: Modular Connectors / Ethernet Connectors; Stock 1: 0; Pricing 1: 1=5.23, 10=5.02, 25=4.58, 100=4.19, 250=3.66, 500=3.56, 1000=3.03, 2500=2.82 (EUR); Contact Plating: Gold; Housing Material: Thermoplastic; Packaging: Tray; Product: Modular Jacks; Series: 826; Termination Style: Through Hole; Brand: Bel Fuse; Flammability Rating: UL 94 V-0; Mounting Style: Panel; Standard Pack Qty: 40; Tradename: MagJack; USOC Codes: RJ45; RoHS - Mouser: Y; Minimum Order Quantity: 1; Reeling: False; ComponentLink1URL: http://www.mouser.com/ds/2/643/0826-1L1T-57-F-532261.pdf; ComponentLink1Description: http://www.mouser.com/ds/2/643/0826-1L1T-57-F-532261.pdf; Supplier 2: Digi-Key; Supplier Part Number 2: 507-1431-ND; Supplier 3: Farnell; Stock 3: 92210; Pricing 3: 10=0.181, 100=0.0749, 500=0.0692, 1000=0.0478, 2500=0.0401 (GBP); ComponentLink2URL: http://www.onsemi.com/PowerSolutions/supportDoc.do?type=models&rpn=MRA4007; ComponentLink2Description: http://www.onsemi.com/PowerSolutions/supportDoc.do?type=models&rpn=MRA4007; ComponentLink3URL: http://www.farnell.com/datasheets/2028669.pdf; ComponentLink3Description: http://www.farnell.com/datasheets/2028669.pdf; ComponentLink4URL: http://www.farnell.com/datasheets/2037280.pdf; ComponentLink4Description: http://www.farnell.com/datasheets/2037280.pdf; Supplier Part Number 3: 1459137
TP17-TP20 TP22 = TEST_POINT: Test point
U3 = SRV05-4ATCT: TVS DIODE 5VWM 17.5VC SOT23-6; Manufacturer: Semtech Corporation; Voltage - Reverse Standoff (Typ): 5V (Max); Voltage - Breakdown (Min): 6V; Voltage - Clamping (Max) @ Ipp: 17.5V; Current - Peak Pulse (10/1000µs): 12A (8/20µs); Power - Peak Pulse: 300W; Power Line Protection: Yes; Capacitance @ Frequency: 3pF @ 1MHz; Supplier 1: Digi-Key; Manufacturer Part Number: SRV05-4ATCT; RoHS: RoHS Compliant; Category: Circuit Protection; Stock 1: 15433; Pricing 1: 1=1.19, 10=1.054, 25=0.9516, 100=0.8328, 250=0.7308, 500=0.64582, 1000=0.50985 (USD); Packaging: Cut Tape (CT); Part Status: Active; Type: Steering (Rail to Rail); Applications: General Purpose; Operating Temperature: -55°C ~ 125°C (TJ); Mounting Type: Surface Mount; Package / Case: SOT-23-6; Supplier Device Package: SOT-23-6; ComponentLink1URL: http://www.semtech.com/images/datasheet/srv05-4a.pdf; ComponentLink1Description: http://www.semtech.com/images/datasheet/srv05-4a.pdf; Supplier Part Number 1: SRV05-4ATCTCT-ND
U5 = LAN9514-JZX: MICROCHIP - LAN9514-JZX - IC, USB2 - ENET CNTRL 4-PORT HUB, 64VQFN; Supplier 1: Farnell; Manufacturer: MICROCHIP; Manufacturer Part Number: LAN9514-JZX; RoHS: YES; Stock 1: 1046; Pricing 1: 1=5.09, 10=4.39, 25=3.94, 50=3.66, 100=3.36 (GBP); ComponentLink1URL: http://www.farnell.com/datasheets/1686386.pdf; ComponentLink1Description: http://www.farnell.com/datasheets/1686386.pdf; ComponentLink2URL: http://www.farnell.com/cad/1726731.zip; ComponentLink2Description: http://www.farnell.com/cad/1726731.zip; ComponentLink3URL: http://www.farnell.com/datasheets/2158582.pdf; ComponentLink3Description: http://www.farnell.com/datasheets/2158582.pdf; Supplier Part Number 1: 2292587
U6 = FSUSB42MUX: FAIRCHILD SEMICONDUCTOR - FSUSB42MUX - USB SWITCH, DUAL, DPDT, MSOP-10; No. of Channels: 2; On State Resistance Max: 4.5; Supply Voltage Range: 2.4V to 3.6; Analogue Switch Case: MSOP; No. of Pins: 10; SVHC: No SVHC (15-Jun-2015; Supplier 1: Farnell; Manufacturer: FAIRCHILD SEMICONDUCTOR; Manufacturer Part Number: FSUSB42MUX; RoHS: YES; Stock 1: 1029; Pricing 1: 1=0.246, 10=0.193, 100=0.187, 250=0.181, 500=0.175, 1000=0.17 (GBP); Analogue Switch Type: DPDT; Operating Temperature Min: -40; Operating Temperature Max: 85; Packaging: Cut Tape; Product Range: -; Automotive Qualification Standard: -; MSL: MSL 1 - Unlimited; ComponentLink1URL: http://www.farnell.com/datasheets/2246555.pdf; ComponentLink1Description: http://www.farnell.com/datasheets/2246555.pdf; Supplier Part Number 1: 2564479
U8 U10 U12 U14 = AP2553FDC-7: IC PD SW CURR LIMIT 6DFN; Manufacturer: Diodes Incorporated; Switch Type: General Purpose; Number of Outputs: 1; Ratio - Input:Output: 1:1; Output Configuration: High Side; Output Type: P-Channel; Interface: On/Off; Voltage - Load: 2.7 V ~ 5.5 V; Voltage - Supply (Vcc/Vdd): Not Required; Current - Output (Max): 2.1A; Rds On (Typ): 80 mOhm; Input Type: Non-Inverting; Fault Protection: Current Limiting (Adjustable), Over Temperature, Reverse Current, UVLO; Supplier 1: Digi-Key; Manufacturer Part Number: AP2553FDC-7; RoHS: RoHS Compliant; Category: Integrated Circuits (ICs); Stock 1: 10636; Pricing 1: 1=0.5, 10=0.425, 100=0.3172, 500=0.24926, 1000=0.19261 (USD); Packaging: Cut Tape (CT); Part Status: Active; Features: Load Discharge, Status Flag; Operating Temperature: -40°C ~ 125°C (TJ); Package / Case: 6-UDFN Exposed Pad; Supplier Device Package: 6-DFN2020C (2x2); ComponentLink1URL: https://www.diodes.com/assets/Datasheets/AP255x.pdf; ComponentLink1Description: https://www.diodes.com/assets/Datasheets/AP255x.pdf; Supplier Part Number 1: AP2553FDC-7DICT-ND
U9 U11 U13 U15 = USBLC6-2SC6: STMICROELECTRONICS - USBLC6-2SC6 - ESD PROTECTION, 3.5PF, 17V, SOT23; Clamping Voltage Vc Max: 17; Diode Case Style: SOT-23; No. of Pins: 6; Product Range: USBLC Series; SVHC: No SVHC (17-Dec-2015); Diode Type: Low Capacitance, ESD Protection; USB Standard: USB 2.0<!--FANDB--><div class="features-and-benefits-container"><div class="features-and-benefits-description"><span class="features-benefits-value">The USBLC6-2SC6 from STMicroelectronics is a very low capacitance ESD protection device in 6pin SOT-23 package. This monolithic application specific device is dedicated to ESD protection of high speed interfaces such as USB 2.0, Ethernet links and video lines. The very low line capacitance secures a high level of signal integrity without compromising in protecting sensitive chips against most stringently characterized ESD strikes. It also provides optimized data integrity and speed. The USBLC6-2SC6 features enhanced ESD protection (IEC 61000-4-2 level 4 compliance) hence results in greater immunity at system level. It offers fast response time and low leakage current for longer operation of battery powered devices.</span></div><div class="features-and-benefits-list"><ul class="features-and-benefits-list-list"><li class="features-and-benefits-list-item">Two data line protection</li><li class="features-and-benefits-list-item">Capacitance between I/O and GND is 2.5pF at VR=1.65V</li><li class="features-and-benefits-list-item">Very low leakage current of 10nA</li><li class="features-and-benefits-list-item">Low PCB space consumption (9mm² for SOT23-6L package)</li><li class="features-and-benefits-list-item">ESD protection of VBUS</li><li class="features-and-benefits-list-item">High reliability offered by monolithic integration</li><li class="features-and-benefits-list-item">Clamping voltage (Vcl) of 17V at IPP=5A and 8/20?s</li><li class="features-and-benefits-list-item">Breakdown voltage (Vbr) of 6V between VBUS and GND at IR=1mA</li><li class="features-and-benefits-list-item">Peak pulse voltage (Vpp) of 25KV according to MIL STD883G method 3015-7</li><li class="features-and-benefits-list-item">Operating junction temperature range from -40°C to 125; Supplier 1: Farnell; Manufacturer: STMICROELECTRONICS; Manufacturer Part Number: USBLC6-2SC6; RoHS: YES; Stock 1: 8817; Pricing 1: 1=0.215, 80=0.149, 250=0.148, 750=0.146, 1500=0.145 (GBP); Operating Voltage: 6; Power Dissipation Pd: -; Packaging: Cut Tape; Automotive Qualification Standard: -; MSL: MSL 1 - Unlimited; Operating Temperature Range: -50°C to +125; Termination Type: Surface Mount Device; ComponentLink1URL: http://www.farnell.com/datasheets/1738051.pdf; ComponentLink1Description: http://www.farnell.com/datasheets/1738051.pdf; ComponentLink2URL: http://www.farnell.com/datasheets/2158622.pdf; ComponentLink2Description: http://www.farnell.com/datasheets/2158622.pdf; Supplier Part Number 1: 1269406
Y1 = ABM8-25.000MHZ-B2-T: ABRACON - ABM8-25.000MHZ-B2-T - CRYSTAL, 25M, 18PF CL, 3.2X2.5MM SMT; Frequency Nom: 25; Crystal Case: SMD, 3.2mm x 2.5; Frequency Stability + / -: 50; Load Capacitance: 18; Frequency Tolerance + / -: 20; Product Range: ABM8 Series; SVHC: No SVHC (15-Jun-2015); Accuracy: ± 20; Crystal Mounting Type: SMD; Frequency Stability: ± 50; No. of Pins: 4; Supplier 1: Farnell; Manufacturer: ABRACON; Manufacturer Part Number: ABM8-25.000MHZ-B2-T; RoHS: YES; Stock 1: 4212; Pricing 1: 1=1.09, 2=0.9, 3=0.807, 5=0.745, 10=0.696, 20=0.658, 50=0.633, 100=0.621 (GBP); Operating Temperature Min: -20; Operating Temperature Max: 70; Frequency: 25; Operating Temperature Range: -20°C to +70; Output Frequency: 25; Packaging: Cut Tape<!--FANDB--><div class="features-and-benefits-container"><div class="features-and-benefits-description"><span class="features-benefits-value">The ABM8-25.000MHZ-B2-T is a 3.2 x 2.5 x 0.8mm 20ppm ultra miniature ceramic surface-mount Crystal features seam sealed assures high reliability, tight tolerance and stability. The ABM8 series crystal for use with the modems, communication and test equipment, PMCIA, wireless and high density applications. It is suitable for reflow profile.</span></div><div class="features-and-benefits-list"><ul class="features-and-benefits-list-list"><li class="features-and-benefits-list-item">Fundamental operation mode</li><li class="features-and-benefits-list-item">50; ComponentLink1URL: http://www.farnell.com/datasheets/1883676.pdf; ComponentLink1Description: http://www.farnell.com/datasheets/1883676.pdf; Supplier Part Number 1: 1611821